# EasyEDA schematic Schematic (EasyEDA).json
TITLE: TINY PROJECT; REV: 1.0; Date: 2021-07-12; Sheet: 1/1; Drawn By: AnaPovea; Company: FEDEVEL ACADEMY
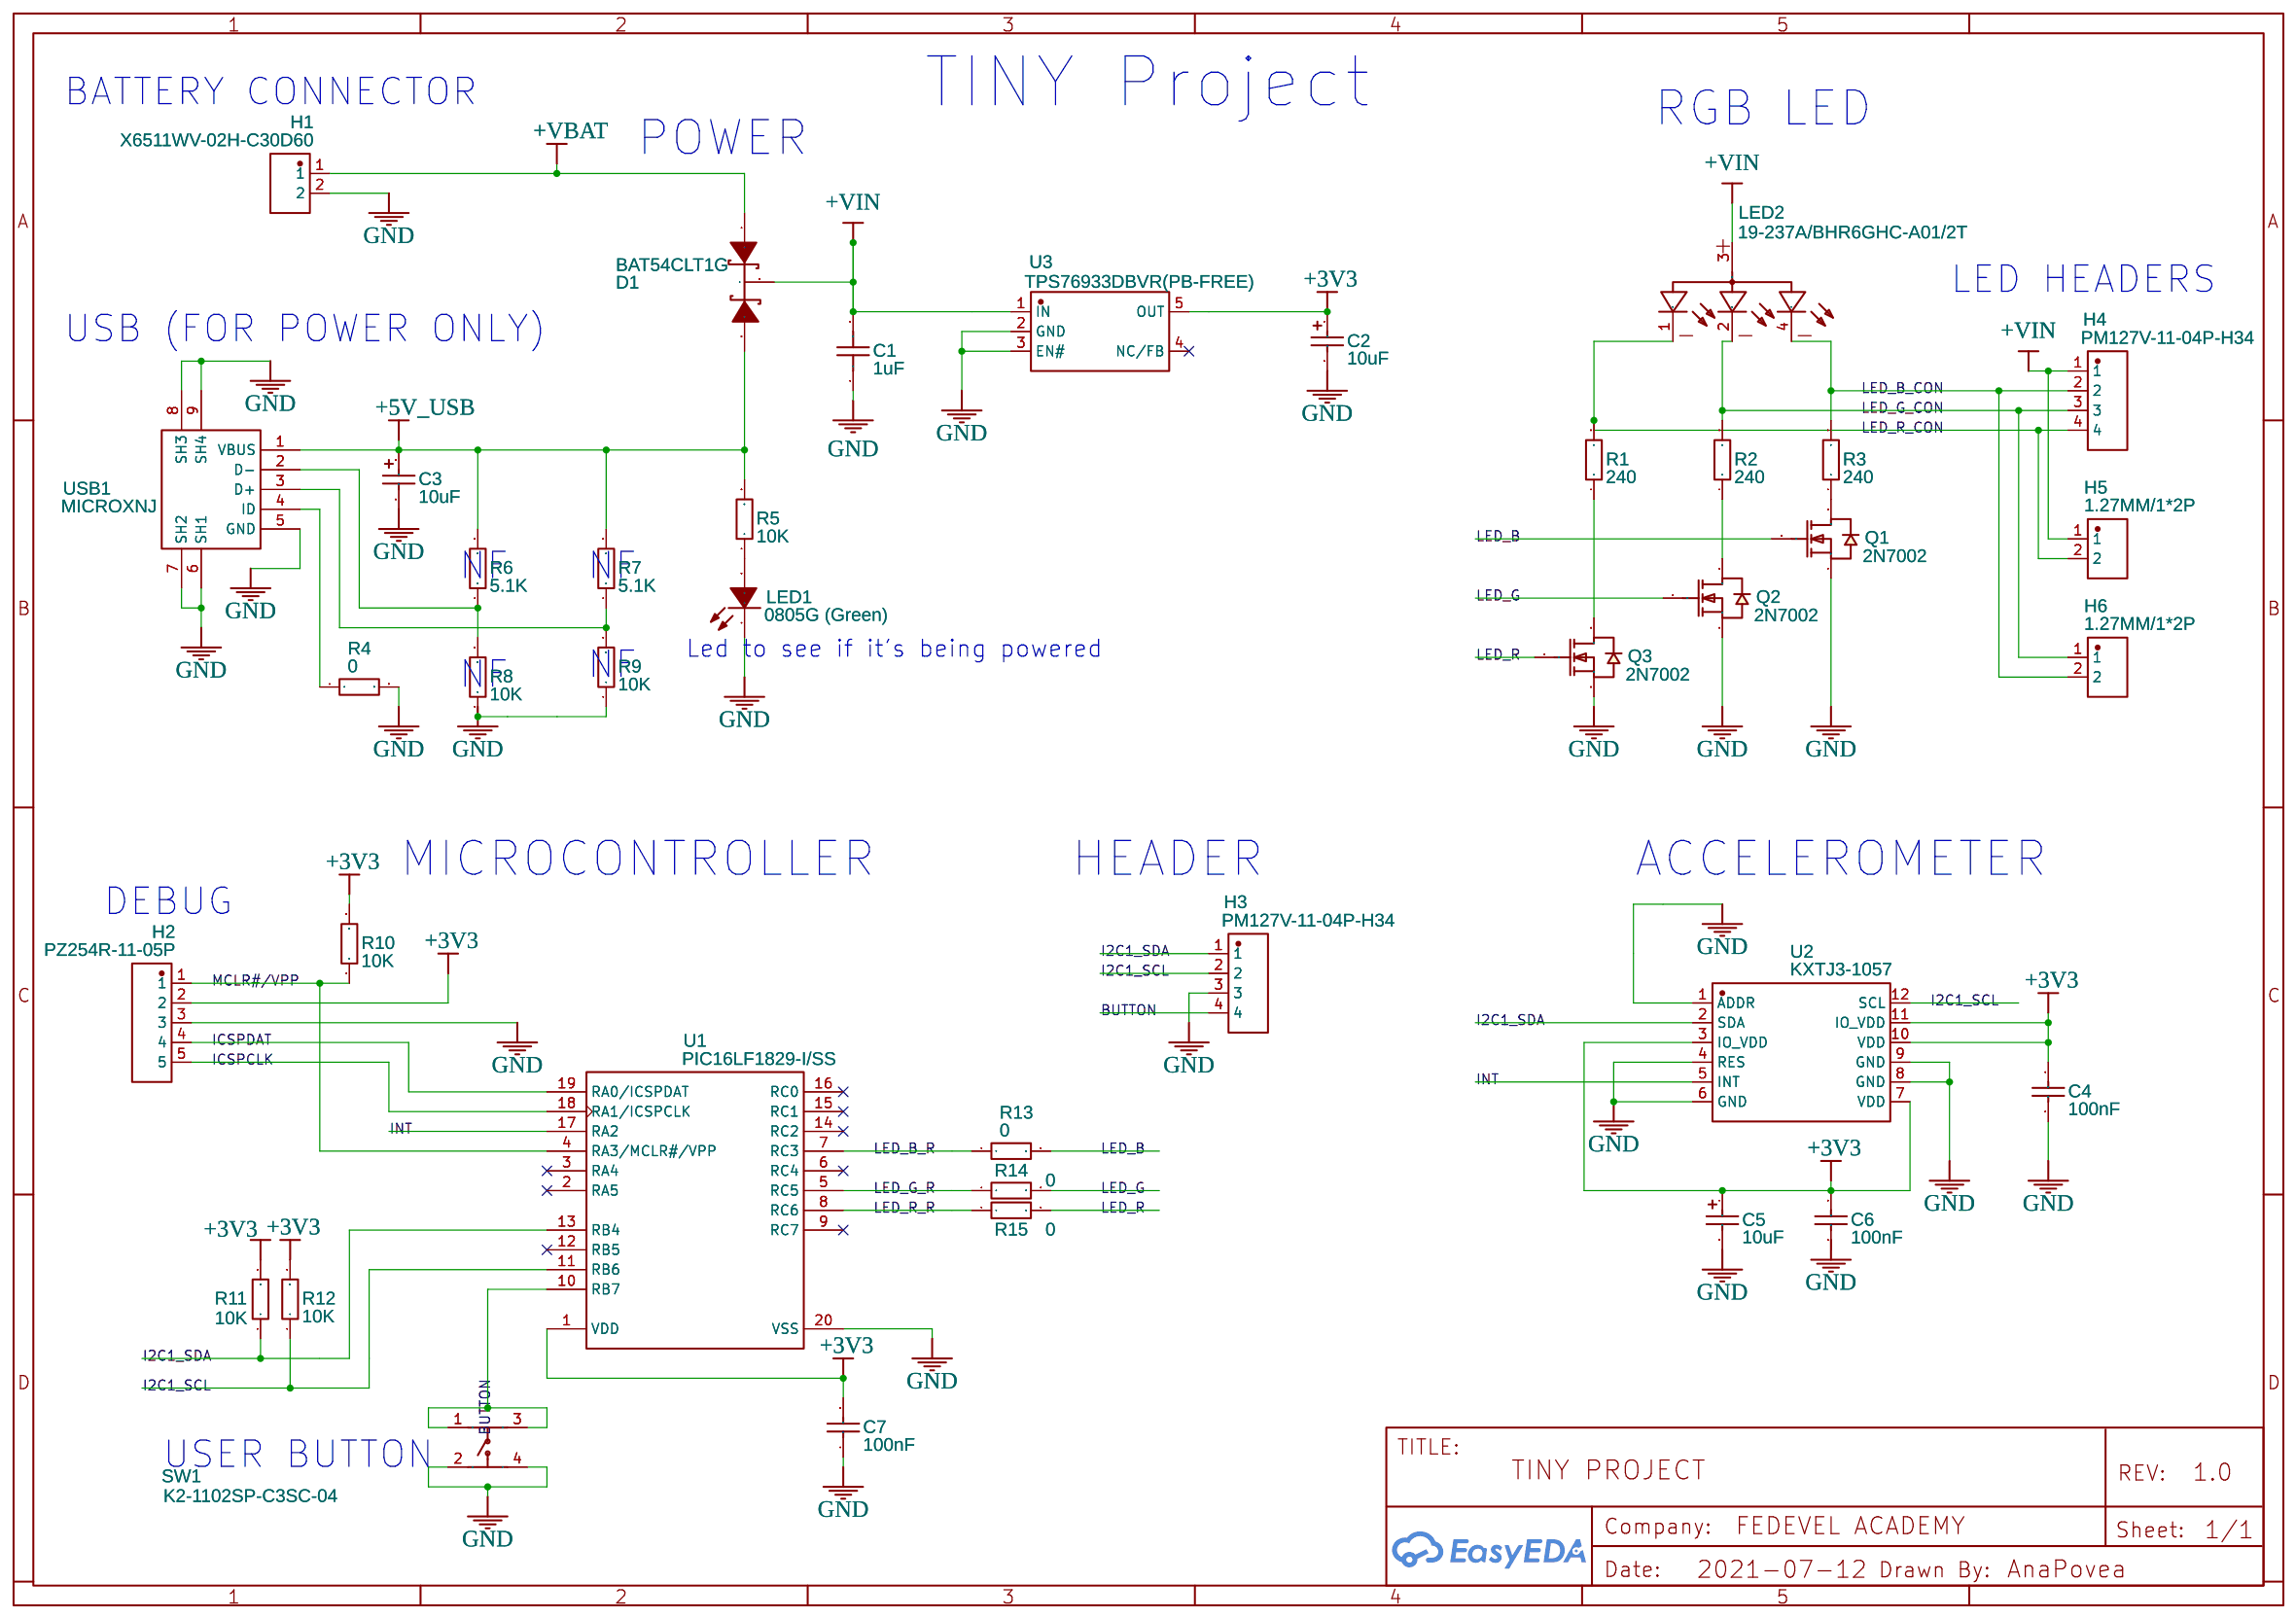
[diagram p0: schematic sheet]

## Parts
C1  1uF  [C0402]
C2  10uF  [CAP-SMD_L3.2-W1.6-R-RD]
C3  10uF  [CAP-SMD_L3.2-W1.6-R-RD]
C4  100nF  [C0402_NEW]
C5  10uF  [CAP-SMD_L3.2-W1.6-R-RD]
C6  100nF  [C0402_NEW]
C7  100nF  [C0402_NEW]
D1  BAT54CLT1G  [SOT-23-3_L2.9-W1.6-P1.90-LS2.8-BR]
H1  X6511WV-02H-C30D60  [HDR-TH_2P-P2.54-V-M]
H2  PZ254R-11-05P  [HDR-TH_5P-P2.54-H-M-W10.4]
H3  PM127V-11-04P-H34  [HDR-TH_4P-P1.27-V-F]
H4  PM127V-11-04P-H34  [HDR-TH_4P-P1.27-V-F]
H5  1.27MM/1*2P  [HDR-TH_2P-P1.27-V-M]
H6  1.27MM/1*2P  [HDR-TH_2P-P1.27-V-M]
LED1  0805G (Green)  [LED0805-RD]
LED2  19-237A/BHR6GHC-A01/2T  [LED-SMD_4P-L1.6-W1.6-BR-RD]
Q1  2N7002  [SOT-23-3_L2.9-W1.3-P1.90-LS2.4-BR]
Q2  2N7002  [SOT-23-3_L2.9-W1.3-P1.90-LS2.4-BR]
Q3  2N7002  [SOT-23-3_L2.9-W1.3-P1.90-LS2.4-BR]
R1  240  [R0402]
R2  240  [R0402]
R3  240  [R0402]
R4  0  [R0402]
R5  10K  [R0402]
R6  5.1K  [R0402]
R7  5.1K  [R0402]
R8  10K  [R0402]
R9  10K  [R0402]
R10  10K  [R0402]
R11  10K  [R0402]
R12  10K  [R0402]
R13  0  [R0402]
R14  0  [R0402]
R15  0  [R0402]
SW1  K2-1102SP-C3SC-04  [SW-SMD_4P-L6.0-W6.0-P4.50-LS9.0]
U1  PIC16LF1829-I/SS  [SSOP-20_L7.2-W5.3-P0.65-LS7.8-BL]
U2  KXTJ3-1057  [LGA-12_L2.0-W2.0-P0.50-BL]
U3  TPS76933DBVR(PB-FREE)  [SOT-23-5_L3.0-W1.7-P0.95-LS2.8-BR]
USB1  MICROXNJ  [MICRO-USB-SMD_MICROXNJ]

## Library data of the parts
C1 = CL05A105KA5NQNC: Supplier: LCSC; Manufacturer: SAMSUNG; Supplier Part: C52923; JLCPCB Part Class: Basic Part
C2 C3 C5 = TAJA106K016RNJ: Supplier: LCSC; Manufacturer: AVX; Supplier Part: C7171; JLCPCB Part Class: Basic Part
C4 C6 C7 = CL05B104KO5NNNC: Supplier: LCSC; Manufacturer: SAMSUNG; Supplier Part: C1525; JLCPCB Part Class: Basic Part
D1 = BAT54CLT1G: Supplier: LCSC; Manufacturer: ON; Supplier Part: C14308; JLCPCB Part Class: Extended Part
H1 = X6511WV-02H-C30D60: Supplier: LCSC; Supplier Part: C706874; Manufacturer: XKB Connectivity; Contributor: LCSC; JLCPCB Part Class: Extended Part
H2 = PZ254R-11-05P: Supplier: LCSC; Supplier Part: C492413; Manufacturer: XFCN; Contributor: LCSC; JLCPCB Part Class: Extended Part
H3 H4 = PM127V-11-04P-H34: Supplier: LCSC; Supplier Part: C492398; Manufacturer: XFCN; Contributor: LCSC; JLCPCB Part Class: Extended Part
H5 H6 = 1.27MM/1*2P: Supplier: LCSC; Supplier Part: C703015; Manufacturer: BOOMELE(Boom Precision Elec); Manufacturer Part: 1.27mm/1*2P; Contributor: LCSC; JLCPCB Part Class: Extended Part
LED1 = 0805G (Green): Supplier: LCSC; Manufacturer: KENTO; Supplier Part: C2297; JLCPCB Part Class: Basic Part
LED2 = 19-237A/BHR6GHC-A01/2T: Supplier: LCSC; Supplier Part: C114830; Manufacturer: Everlight Elec; Contributor: LCSC; JLCPCB Part Class: Extended Part
Q1-Q3 = 2N7002: Supplier: LCSC; Manufacturer: CJ; Supplier Part: C8545; JLCPCB Part Class: Basic Part
R1-R3 = 0402WGF2400TCE: Supplier: LCSC; Manufacturer: UniOhm; Supplier Part: C25094; JLCPCB Part Class: Extended Part
R4 R13-R15 = 0402WGF0000TCE: Supplier: LCSC; Manufacturer: UniOhm; Supplier Part: C17168; JLCPCB Part Class: Basic Part
R5 R8-R12 = 0402WGF1002TCE: Supplier: LCSC; Manufacturer: UniOhm; Supplier Part: C25744; JLCPCB Part Class: Basic Part
R6 R7 = 0402WGF5101TCE: Supplier: LCSC; Manufacturer: UniOhm; Supplier Part: C25905; JLCPCB Part Class: Basic Part
SW1 = K2-1102SP-C3SC-04: Supplier: LCSC; Supplier Part: C707347; Manufacturer: Korean Hroparts Elec; Contributor: LCSC; JLCPCB Part Class: Extended Part
U1 = PIC16LF1829-I/SS: Supplier: LCSC; Manufacturer: MICROCHIP; Supplier Part: C59149; JLCPCB Part Class: Extended Part
U2 = KXTJ3-1057: Supplier: LCSC; Supplier Part: C442603; Manufacturer: ROHM Semicon; Contributor: LCSC; JLCPCB Part Class: Extended Part
U3 = TPS76933DBVR(PB-FREE): Supplier: LCSC; Manufacturer: TI; Supplier Part: C7101; JLCPCB Part Class: Extended Part
USB1 = MICROXNJ: Supplier: LCSC; Supplier Part: C404969; Manufacturer: SHOU HAN; Manufacturer Part: MicroXNJ; Contributor: LCSC; JLCPCB Part Class: Extended Part

## Nets
+3V3: C2.1 C4.2 C5.1 C6.2 C7.2 H2.2 R10.2 R11.2 R12.2 U1.1(VDD) U2.3(IO_VDD) U2.7(VDD) U2.10(VDD) U2.11(IO_VDD) U3.5(OUT)
+5V_USB: C3.1 D1.2(A) R5.2 R6.2 R7.2 USB1.1(VBUS)
+VBAT: D1.1(A) H1.1
+VIN: C1.2 D1.3(K) H4.1 H5.1 LED2.3 U3.1(IN)
GND: C1.1 C2.2 C3.2 C4.1 C5.2 C6.1 C7.1 H1.2 H2.3 H3.3 LED1.1(K) Q1.2(S) Q2.2(S) Q3.2(S) R4.2 R8.1 R9.1 SW1.2 SW1.4 U1.20(VSS) U2.1(ADDR) U2.4(RES) U2.6(GND) U2.8(GND) U2.9(GND) U3.2(GND) U3.3(EN#) USB1.5(GND) USB1.6(SH1) USB1.7(SH2) USB1.8(SH3) USB1.9(SH4)
BUTTON: H3.4 SW1.1 SW1.3 U1.10(RB7)
I2C1_SCL: H3.2 R12.1 U1.11(RB6) U2.12(SCL)
I2C1_SDA: H3.1 R11.1 U1.13(RB4) U2.2(SDA)
ICSPCLK: H2.5 U1.18(RA1/ICSPCLK)
ICSPDAT: H2.4 U1.19(RA0/ICSPDAT)
INT: U1.17(RA2) U2.5(INT)
LED_B: Q1.1(G) R13.2
LED_B_CON: H4.2 H6.2 LED2.4 R3.2
LED_B_R: R13.1 U1.7(RC3)
LED_G: Q2.1(G) R14.2
LED_G_CON: H4.3 H6.1 LED2.2 R2.2
LED_G_R: R14.1 U1.5(RC5)
LED_R: Q3.1(G) R15.2
LED_R_CON: H4.4 H5.2 LED2.1 R1.2
LED_R_R: R15.1 U1.8(RC6)
MCLR#/VPP: H2.1 R10.1 U1.4(RA3/MCLR#/VPP)
Net-(LED1-2): LED1.2(A) R5.1
Net-(Q1-3): Q1.3(D) R3.1
Net-(Q2-3): Q2.3(D) R2.1
Net-(Q3-3): Q3.3(D) R1.1
Net-(R4-1): R4.1 USB1.4(ID)
Net-(R6-1): R6.1 R8.2 USB1.2(D-)
Net-(R7-1): R7.1 R9.2 USB1.3(D+)

Not connected (* = marked no-connect by the designer): U1 2(RA5)* 3(RA4)* 6(RC4)* 9(RC7)* 12(RB5)* 14(RC2)* 15(RC1)* 16(RC0)*; U3 4(NC/FB)*

## Notes on the sheet
- TINY Project
- BATTERY CONNECTOR
- RGB LED
- POWER
- LED HEADERS
- USB (FOR POWER ONLY)
- NF
- NF
- NF
- Led to see if it's being powered
- NF
- MICROCONTROLLER
- HEADER
- ACCELEROMETER
- DEBUG
- USER BUTTON
